# Altium project USB-C Power Controller.PrjPcb
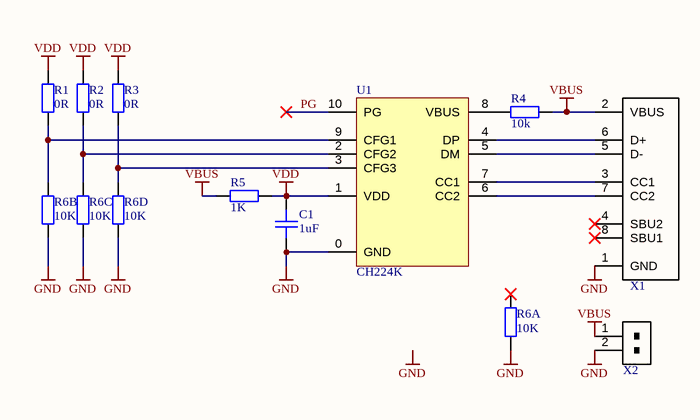
[diagram p0: Power Controller.SchDoc]
DrawingScale: 1:1; ProjAuthor: Szabó Péter; ProjName: USB-C Power Controler; ProjRev: Rev.1.0.
1 sheet, 11 parts. Net scope: global (net labels, ports and power ports of the same name join across sheets).
Board file: USB-C Power Controller.PcbDoc

## Sheet Power Controller.SchDoc
size 297 x 209 mm; DrawnBy: Szabó Péter; Revision: Rev.1.0.; SheetNumber: 1; SheetTotal: 1; Project: USB-C Power Controler; Scale: 1:1

### Parts
C1  1uF  [CAP-0805]
MH1  MECH-SCREW  [MECH-M2-LARGE-EMPTY-NORMAL-SUPPORT]  (value not drawn)
R1  0R  [RES-0603]
R2  0R  [RES-0603]
R3  0R  [RES-0603]
R4  10k  [RES-0603]
R5  1K  [RES-0603]
R6  10K  [RES-ARRAY-1206]  (parts A,B,C,D of 4)
U1  CH224K  [IC-TSSOP-10-TP]
X1  CONN-USB-C-DATA  [CONN-USB-C-DATA]  (value not drawn)
X2  CONN-2P  [CONN-2P-JST-2.0MM-RIGHT]  (value not drawn)

### Nets
GND: C1.1 MH1.MH(Con) R6.1 R6.2 R6.3 R6.4 U1.0(GND) X1.1(GND) X2.2
VBUS: R4.1 R5.1 X1.2(VBUS) X2.1
VDD: C1.2 R1.2 R2.2 R3.2 R5.2 U1.1(VDD)
PG: U1.10(PG)
NetR1_1: R1.1 R6.7 U1.9(CFG1)
NetR2_1: R2.1 R6.6 U1.2(CFG2)
NetR3_1: R3.1 R6.5 U1.3(CFG3)
NetR4_2: R4.2 U1.8(VBUS)
NetU1_4: U1.4(DP) X1.6(D+)
NetU1_5: U1.5(DM) X1.5(D-)
NetU1_6: U1.6(CC2) X1.7(CC2)
NetU1_7: U1.7(CC1) X1.3(CC1)

Not connected (* = marked no-connect by the designer): R6 8*; X1 4(SBU2)* 8(SBU1)*

### Notes on the sheet
- PROJECT NAME
- DATE
- TITLE
- TIME
- VERSION CONTROL
- N/A
- SIZE
- SCALE:
- A4
- FILE NAME
- DWG NO.
- SHEET
- REV
- OF
- DRAWN BY:

### Library data of the parts
C1 = SPN-RES-6099: Capacitor Non-Polar; Tolerance: X7R; Voltage: 50V; Value: 1uF; Distributor: Lomex; Order number: 82-10-21; Internal ID: SPN-RES-6099
MH1 = SPN-CON-0000.17: M2, large ring, normal support silkscreen; Distributor: N/A; Order number: N/A; Internal ID: SPN-CON-0000.17
R1-R3 = SPN-RES-5001: Resistor; Value: 0R; Distributor: Lomex; Order number: 81-10-01; Internal ID: SPN-RES-5001
R4 = SPN-RES-5005: Resistor; Value: 10k; Distributor: Lomex; Order number: 80-11-68; Internal ID: SPN-RES-5005
R5 = SPN-RES-5036: Resistor; Value: 1K; Distributor: Lomex; Order number: 80-11-59; Internal ID: SPN-RES-5036
R6 = SPN-RES-5650: 4x resistor array; Value: 10K; Distributor: Lomex; Order number: 00-00-00; Internal ID: SPN-RES-5650
U1 = SPN-ICS-0415: USB PD and Other Fast Charging Protocol Sink Controller; Order number: C970725; Internal ID: SPN-ICS-0415; Distributor: LCSC; Link: https://www.laskakit.cz/user/related_files/ch224ds1.pdf; Value: CH224K
X1 = SPN-CON-0416: Csatlakozó, USB C, 5V, 5A, 16 pin, SMD; Order number: 100.469.70; Value: TYPE-C-16PIN; ComponentLink1Description: DataSheet; Distributor: Hestore; Internal ID: SPN-CON-0416; Link: https://www.hestore.hu/prod_10046970.html
X2 = SPN-CON-0233: TÁPCSATL. 2.00mm 2P APA 90° NCW200S-02R (G-S) FORR.; Distributor: Lomex; Order number: 43-17-36; Internal ID: SPN-CON-0233; Link: https://lomex.hu/pdf/(g-s)_ncw200s-xxr.pdf; Value: NCW200S-02R